# Altium project MIC_760_V2.PrjPcb
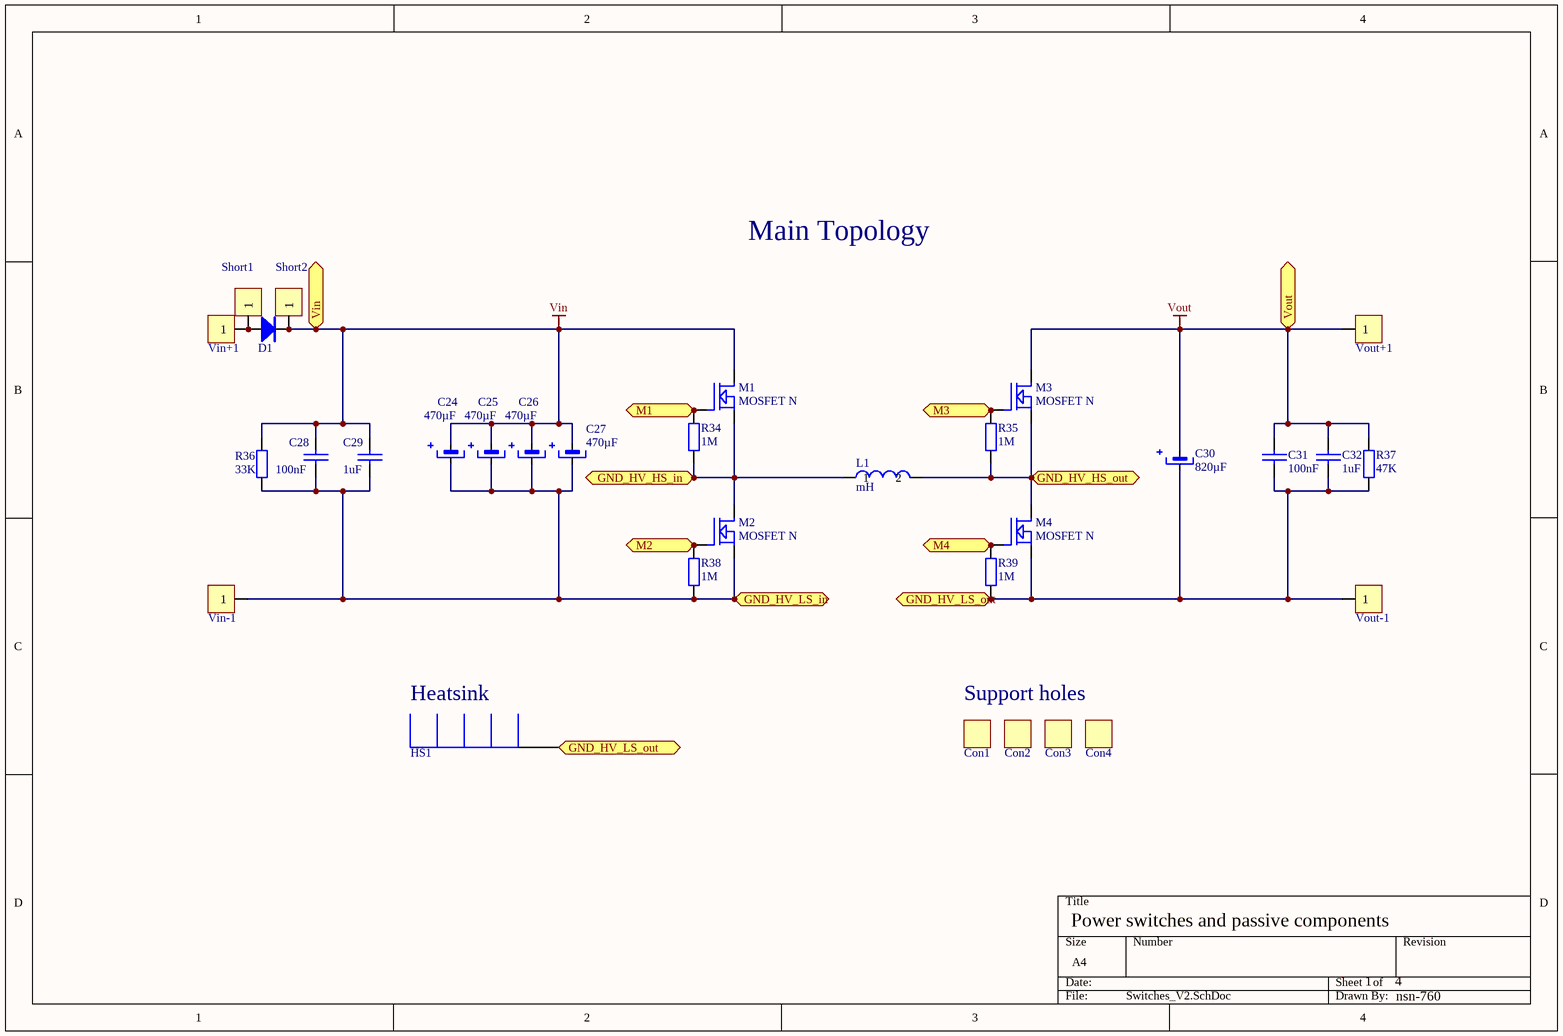
[diagram p0: Switches_V2.SchDoc]
4 sheets, 143 parts. Net scope: flat (ports and power ports of the same name join across sheets).
Board file: PCB5_V2.PcbDoc
Sheets:
  Switches_V2.SchDoc
  Drivers_V2.SchDoc
  Power_supplies_V2.SchDoc
  Signal_processing_V2.SchDoc

## Sheet Switches_V2.SchDoc
size A4

### Parts
C24  470µF  [CE_16Dx35mm_pitch7.5mm]
C25  470µF  [CE_16Dx35mm_pitch7.5mm]
C26  470µF  [CE_16Dx35mm_pitch7.5mm]
C27  470µF  [CE_16Dx35mm_pitch7.5mm]
C28  100nF  [1812]
C29  1uF  [1812]
C30  820µF  [CE_30Dx35mm_pitch10mm]
C31  100nF  [1812]
C32  1uF  [1812]
Con1  Support  [Support]  (value not drawn)
Con2  Support  [Support]  (value not drawn)
Con3  Support  [Support]  (value not drawn)
Con4  Support  [Support]  (value not drawn)
D1  ????  [D2PAK - Diode]  (value not drawn)
HS1  Heatsink  [Heatsink60x60]
L1  mH  [Torus_Coil_1mH]
M1  MOSFET N  [D2PAK - MOSFET]
M2  MOSFET N  [D2PAK - MOSFET]
M3  MOSFET N  [D2PAK - MOSFET]
M4  MOSFET N  [D2PAK - MOSFET]
R34  1M  [1206]
R35  1M  [1206]
R36  33K  [1206]
R37  47K  [1206]
R38  1M  [1206]
R39  1M  [1206]
Short1  CON1  [ShortPad]  (value not drawn)
Short2  CON1  [ShortPad]  (value not drawn)
Vin+1  CON1  [PowerHole]  (value not drawn)
Vin-1  CON1  [PowerHole]  (value not drawn)
Vout+1  CON1  [PowerHole]  (value not drawn)
Vout-1  CON1  [PowerHole]  (value not drawn)

### Ports
GND_HV_HS_in, GND_HV_HS_out, GND_HV_LS_in, GND_HV_LS_out, M1, M2, M3, M4, Vin, Vout

### Nets
GND_HV_HS_in: L1.1 M1.S M2.D R34.2 ; port GND_HV_HS_in
GND_HV_HS_out: L1.2 M3.S M4.D R35.2 ; port GND_HV_HS_out
GND_HV_LS_in: C24.2 C25.2 C26.2 C27.2 C28.2 C29.2 M2.S R36.2 R38.2 Vin-1.1 ; port GND_HV_LS_in
GND_HV_LS_out: C30.2 C31.2 C32.2 HS1.1 M4.S R37.2 R39.2 Vout-1.1 ; port GND_HV_LS_out
Vin: C24.1 C25.1 C26.1 C27.1 C28.1 C29.1 D1.K M1.D R36.1 Short2.1 ; port Vin
Vout: C30.1 C31.1 C32.1 M3.D R37.1 Vout+1.1 ; port Vout
NetD1_A: D1.A Short1.1 Vin+1.1
NetM1_G: M1.G R34.1 ; port M1
NetM2_G: M2.G R38.1 ; port M2
NetM3_G: M3.G R35.1 ; port M3
NetM4_G: M4.G R39.1 ; port M4

### Notes on the sheet
- Main Topology
- Support holes
- Power switches and passive components
- 1
- 4
- nsn-760

### Library data of the parts
C24-C27 C30 = Cond_Electrolítico: Condensador Aluminio con polaridad
C28 C29 C31 C32 = Condensador
D1 = Diodo
L1 = Bobina
M1-M4 = MOSFET N: MOSFET de canal N
R34-R39 = Resistencia: Potencia: 1/4W

## Sheet Drivers_V2.SchDoc
size A4
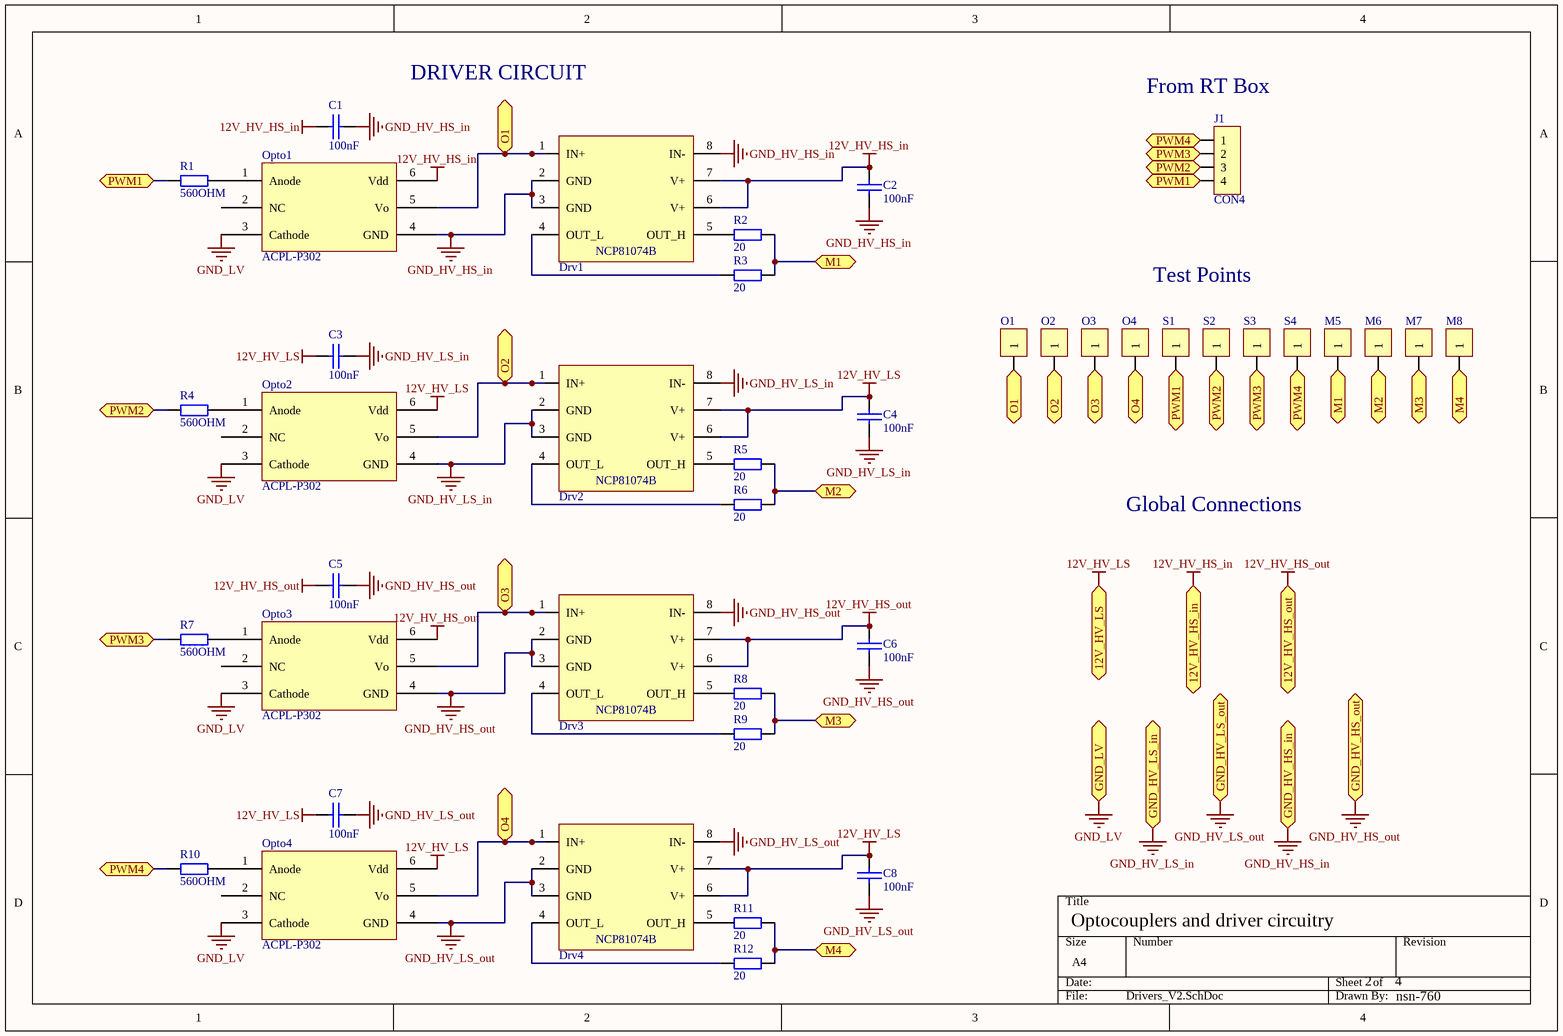
[diagram p1: Drivers_V2.SchDoc]

### Parts
C1  100nF  [1206]
C2  100nF  [1206]
C3  100nF  [1206]
C4  100nF  [1206]
C5  100nF  [1206]
C6  100nF  [1206]
C7  100nF  [1206]
C8  100nF  [1206]
Drv1  NCP81074B  [NCP81074A]  (value not drawn)
Drv2  NCP81074B  [NCP81074A]  (value not drawn)
Drv3  NCP81074B  [NCP81074A]  (value not drawn)
Drv4  NCP81074B  [NCP81074A]  (value not drawn)
J1  CON4  [Con4_Extron _3.5mmPitch]
M5  Test Point  [Test_Point]  (value not drawn)
M6  Test Point  [Test_Point]  (value not drawn)
M7  Test Point  [Test_Point]  (value not drawn)
M8  Test Point  [Test_Point]  (value not drawn)
O1  Test Point  [Test_Point]  (value not drawn)
O2  Test Point  [Test_Point]  (value not drawn)
O3  Test Point  [Test_Point]  (value not drawn)
O4  Test Point  [Test_Point]  (value not drawn)
Opto1  ACPL-P302  [SSOIC6]
Opto2  ACPL-P302  [SSOIC6]
Opto3  ACPL-P302  [SSOIC6]
Opto4  ACPL-P302  [SSOIC6]
R1  560OHM  [1206]
R2  20  [1206]
R3  20  [1206]
R4  560OHM  [1206]
R5  20  [1206]
R6  20  [1206]
R7  560OHM  [1206]
R8  20  [1206]
R9  20  [1206]
R10  560OHM  [1206]
R11  20  [1206]
R12  20  [1206]
S1  Test Point  [Test_Point]  (value not drawn)
S2  Test Point  [Test_Point]  (value not drawn)
S3  Test Point  [Test_Point]  (value not drawn)
S4  Test Point  [Test_Point]  (value not drawn)

### Ports
12V_HV_HS_in, 12V_HV_HS_out, 12V_HV_LS, GND_HV_HS_in, GND_HV_HS_out, GND_HV_LS_in, GND_HV_LS_out, GND_LV, M1, M2, M3, M4, O1, O2, O3, O4, PWM1, PWM2, PWM3, PWM4

### Nets
12V_HV_HS_in: C1.1 C2.1 Drv1.6(V+) Drv1.7(V+) Opto1.6(Vdd) ; port 12V_HV_HS_in
12V_HV_HS_out: C5.1 C6.1 Drv3.6(V+) Drv3.7(V+) Opto3.6(Vdd) ; port 12V_HV_HS_out
12V_HV_LS: C3.1 C4.1 C7.1 C8.1 Drv2.6(V+) Drv2.7(V+) Drv4.6(V+) Drv4.7(V+) Opto2.6(Vdd) Opto4.6(Vdd) ; port 12V_HV_LS
GND_HV_HS_in: C1.2 C2.2 Drv1.2(GND) Drv1.3(GND) Drv1.8(IN-) Opto1.4(GND) ; port GND_HV_HS_in
GND_HV_HS_out: C5.2 C6.2 Drv3.2(GND) Drv3.3(GND) Drv3.8(IN-) Opto3.4(GND) ; port GND_HV_HS_out
GND_HV_LS_in: C3.2 C4.2 Drv2.2(GND) Drv2.3(GND) Drv2.8(IN-) Opto2.4(GND) ; port GND_HV_LS_in
GND_HV_LS_out: C7.2 C8.2 Drv4.2(GND) Drv4.3(GND) Drv4.8(IN-) Opto4.4(GND) ; port GND_HV_LS_out
GND_LV: Opto1.3(Cathode) Opto2.3(Cathode) Opto3.3(Cathode) Opto4.3(Cathode) ; port GND_LV
NetDrv1_1: Drv1.1(IN+) O1.1 Opto1.5(Vo) ; port O1
NetDrv1_4: Drv1.4(OUT_L) R3.2
NetDrv1_5: Drv1.5(OUT_H) R2.2
NetDrv2_1: Drv2.1(IN+) O2.1 Opto2.5(Vo) ; port O2
NetDrv2_4: Drv2.4(OUT_L) R6.2
NetDrv2_5: Drv2.5(OUT_H) R5.2
NetDrv3_1: Drv3.1(IN+) O3.1 Opto3.5(Vo) ; port O3
NetDrv3_4: Drv3.4(OUT_L) R9.2
NetDrv3_5: Drv3.5(OUT_H) R8.2
NetDrv4_1: Drv4.1(IN+) O4.1 Opto4.5(Vo) ; port O4
NetDrv4_4: Drv4.4(OUT_L) R12.2
NetDrv4_5: Drv4.5(OUT_H) R11.2
NetJ1_1: J1.1 R10.2 S4.1 ; port PWM4
NetJ1_2: J1.2 R7.2 S3.1 ; port PWM3
NetJ1_3: J1.3 R4.2 S2.1 ; port PWM2
NetJ1_4: J1.4 R1.2 S1.1 ; port PWM1
NetM1_G: M5.1 R2.1 R3.1 ; port M1
NetM2_G: M6.1 R5.1 R6.1 ; port M2
NetM3_G: M7.1 R8.1 R9.1 ; port M3
NetM4_G: M8.1 R11.1 R12.1 ; port M4
NetOpto1_1: Opto1.1(Anode) R1.1
NetOpto2_1: Opto2.1(Anode) R4.1
NetOpto3_1: Opto3.1(Anode) R7.1
NetOpto4_1: Opto4.1(Anode) R10.1

Not connected (* = marked no-connect by the designer): Opto1 2(NC); Opto2 2(NC); Opto3 2(NC); Opto4 2(NC)

### Notes on the sheet
- DRIVER CIRCUIT
- (near J1) From RT Box
- Test Points
- Global Connections
- Optocouplers and driver circuitry
- 2
- 4
- nsn-760

### Library data of the parts
C1-C8 = Condensador
Opto1-Opto4 = Opto_ACPL
R1-R12 = Resistencia: Potencia: 1/4W

## Sheet Power_supplies_V2.SchDoc
size A4
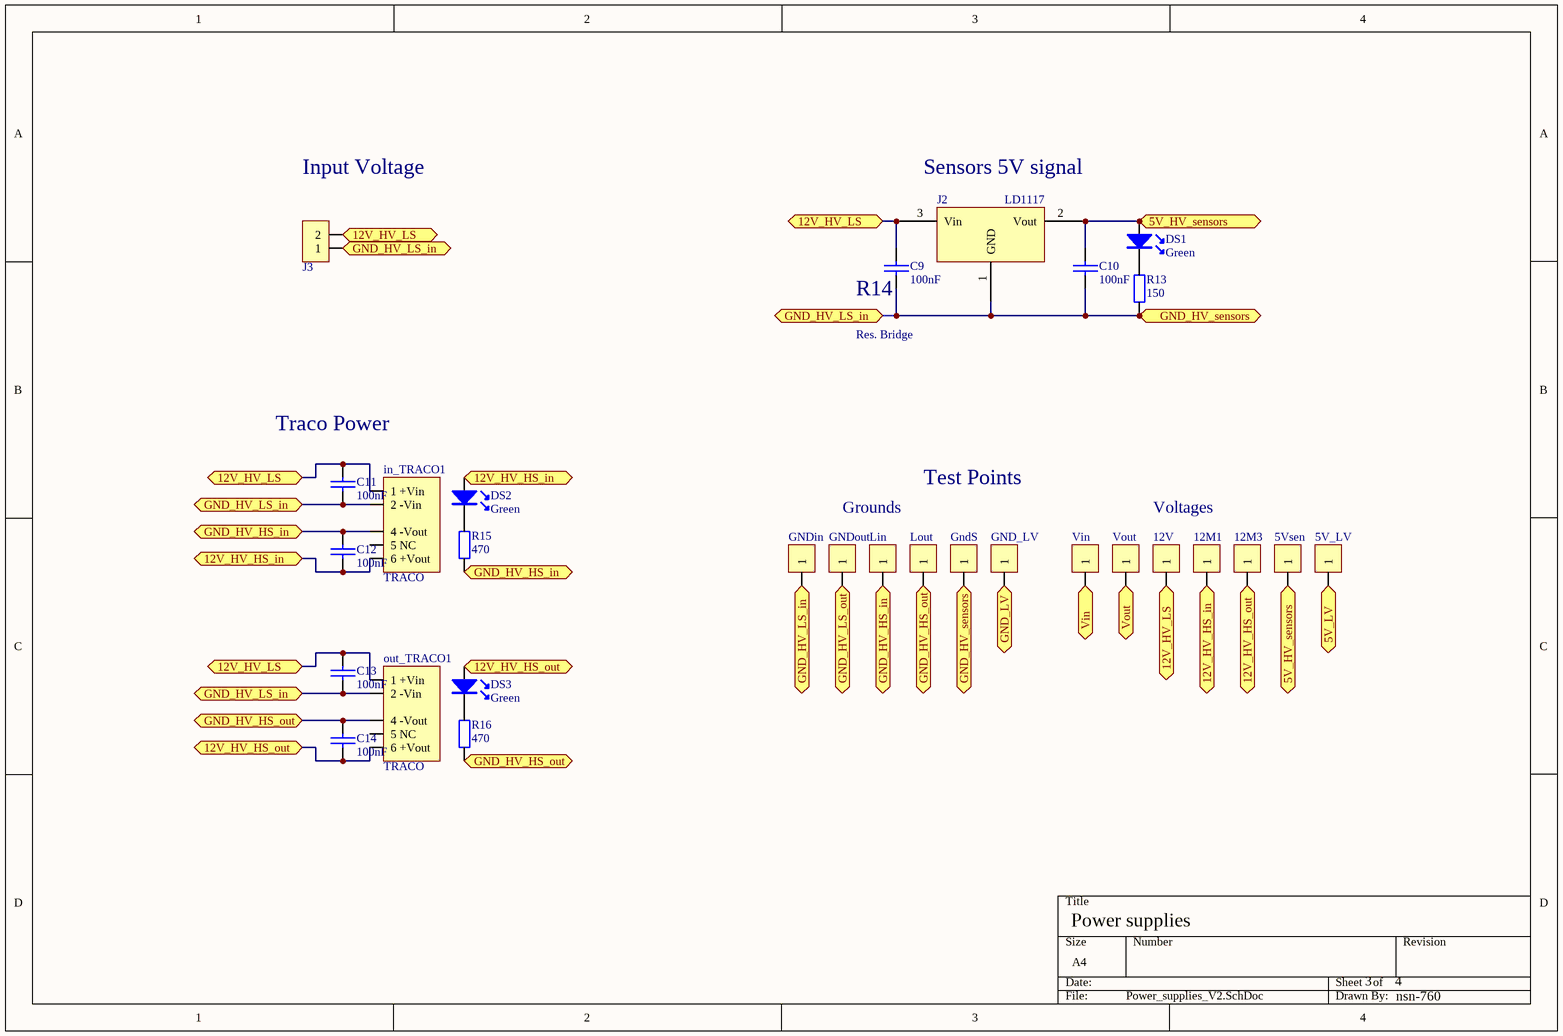
[diagram p2: Power_supplies_V2.SchDoc]

### Parts
5V_LV  Test Point  [Test_Point]  (value not drawn)
5Vsen  Test Point  [Test_Point]  (value not drawn)
12M1  Test Point  [Test_Point]  (value not drawn)
12M3  Test Point  [Test_Point]  (value not drawn)
12V  Test Point  [Test_Point]  (value not drawn)
C9  100nF  [1206]
C10  100nF  [1206]
C11  100nF  [1206]
C12  100nF  [1206]
C13  100nF  [1206]
C14  100nF  [1206]
DS1  Green  [Led 2.2mm]
DS2  Green  [Led 2.2mm]
DS3  Green  [Led 2.2mm]
GND_LV  Test Point  [Test_Point]  (value not drawn)
GNDin  Test Point  [Test_Point]  (value not drawn)
GNDout  Test Point  [Test_Point]  (value not drawn)
GndS  Test Point  [Test_Point]  (value not drawn)
in_TRACO1  TRACO  [TRACO_TMA1212S]
J2  LD1117  [SOT-223_LM1117]
J3  Cleva 2 vias  [Con2_Extron _3.5mmPitch]  (value not drawn)
Lin  Test Point  [Test_Point]  (value not drawn)
Lout  Test Point  [Test_Point]  (value not drawn)
out_TRACO1  TRACO  [TRACO_TMA1212S]
R13  150  [1206]
R14  Res. Bridge  [1206]
R15  470  [1206]
R16  470  [1206]
Vin  Test Point  [Test_Point]  (value not drawn)
Vout  Test Point  [Test_Point]  (value not drawn)

### Ports
5V_HV_sensors, 5V_LV, 12V_HV_HS_in, 12V_HV_HS_out, 12V_HV_LS, GND_HV_HS_in, GND_HV_HS_out, GND_HV_LS_in, GND_HV_LS_out, GND_HV_sensors, GND_LV, Vin, Vout

### Nets
5V_HV: 5Vsen.1 C10.2 DS1.A J2.2(Vout) ; port 5V_HV_sensors
5V_LV: 5V_LV.1 ; port 5V_LV
12V_HV_HS_in: 12M1.1 C12.1 DS2.A in_TRACO1.6(6_+Vout) ; port 12V_HV_HS_in
12V_HV_HS_out: 12M3.1 C14.1 DS3.A out_TRACO1.6(6_+Vout) ; port 12V_HV_HS_out
12V_HV_LS: 12V.1 C9.2 C11.2 C13.2 in_TRACO1.1(1_+Vin) J2.3(Vin) J3.2 out_TRACO1.1(1_+Vin) ; port 12V_HV_LS
GND_HV_HS_in: C12.2 in_TRACO1.4(4_-Vout) Lin.1 R15.2 ; port GND_HV_HS_in
GND_HV_HS_out: C14.2 Lout.1 out_TRACO1.4(4_-Vout) R16.2 ; port GND_HV_HS_out
GND_HV_LS_in: C11.1 C13.1 GNDin.1 in_TRACO1.2(2_-Vin) J3.1 out_TRACO1.2(2_-Vin) R14.1 ; port GND_HV_LS_in
GND_HV_LS_out: GNDout.1 ; port GND_HV_LS_out
GND_HV_sensors: C9.1 C10.1 GndS.1 J2.1(GND) R13.2 R14.2 ; port GND_HV_sensors
GND_LV: GND_LV.1 ; port GND_LV
Vin: Vin.1 ; port Vin
Vout: Vout.1 ; port Vout
NetDS1_K: DS1.K R13.1
NetDS2_K: DS2.K R15.1
NetDS3_K: DS3.K R16.1

Not connected (* = marked no-connect by the designer): in_TRACO1 5(5_NC); out_TRACO1 5(5_NC)

### Notes on the sheet
- Input Voltage
- Sensors 5V signal
- Traco Power
- Grounds
- Test Points
- Voltages
- Power supplies
- 3
- 4
- nsn-760

### Library data of the parts
C9-C14 = Condensador
DS1-DS3 = Led
in_TRACO1 out_TRACO1 = TRACO: TracoPower TMA1212S
J2 = LD1117: Linear voltage regulator
J3 = Con_2
R13 R15 R16 = Resistencia: Potencia: 1/4W
R14 = Res. Bridge: Resistencia Bridge

## Sheet Signal_processing_V2.SchDoc
size A4
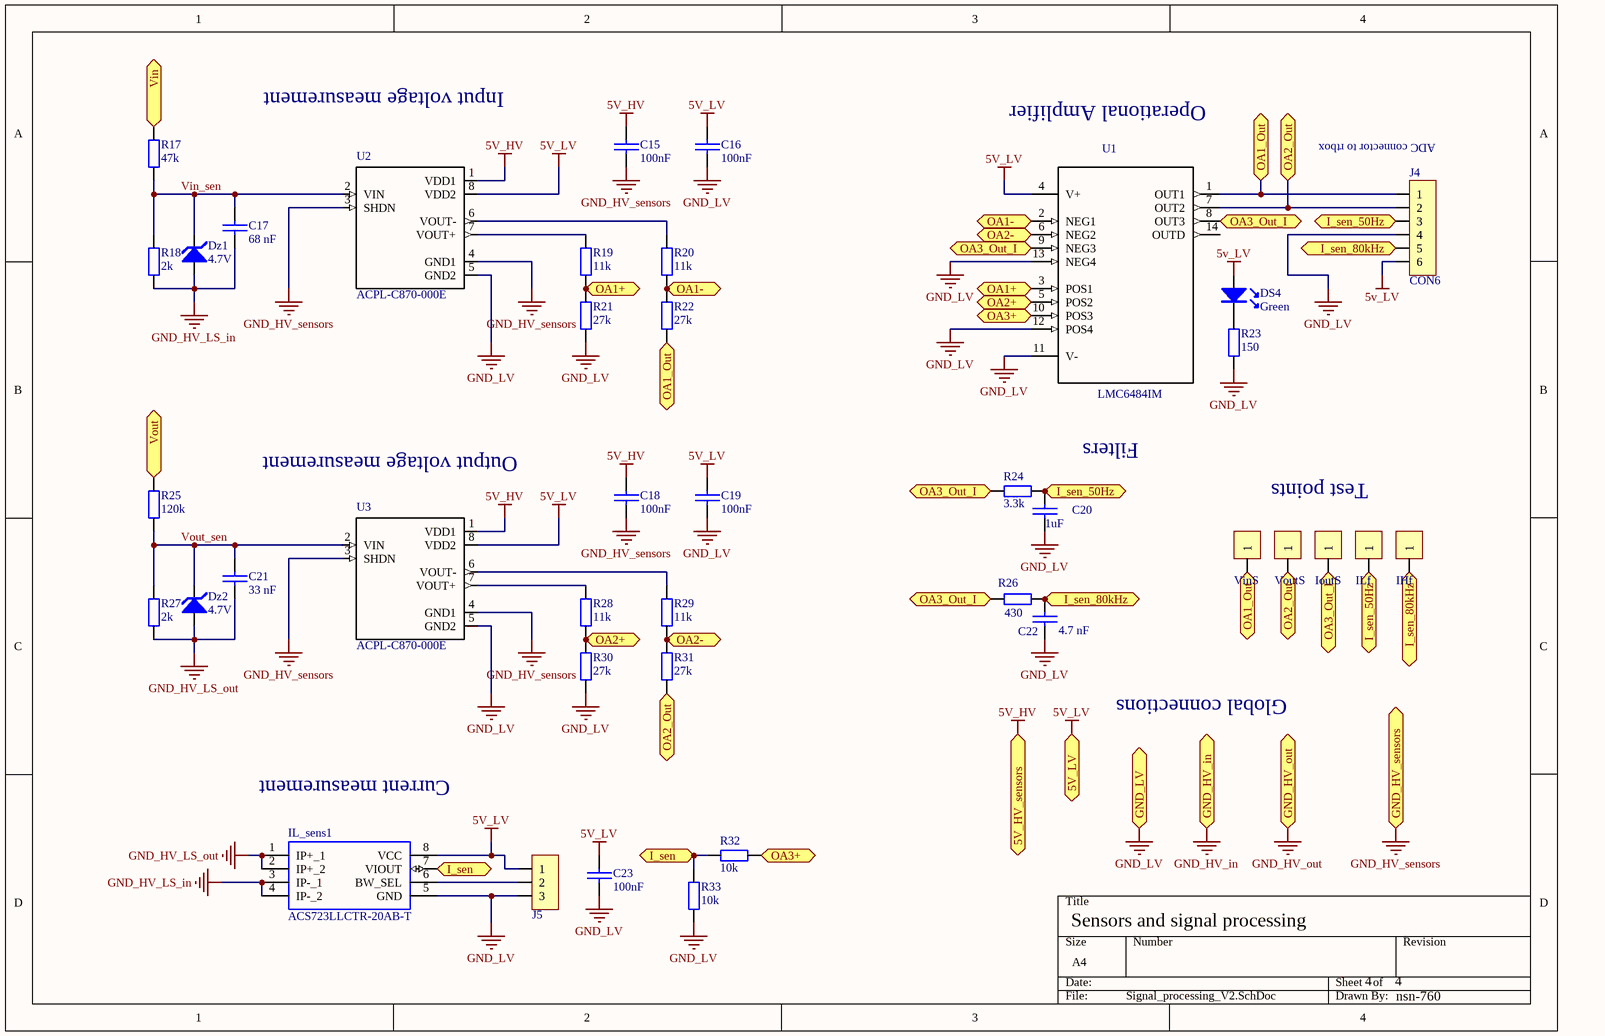
[diagram p3: Signal_processing_V2.SchDoc]

### Parts
C15  100nF  [1206]
C16  100nF  [1206]
C17  68 nF  [Condensador_MKP_200milis - duplicate]
C18  100nF  [1206]
C19  100nF  [1206]
C20  1uF  [Condensador_MKP_200milis - duplicate]
C21  33 nF  [Condensador_MKP_200milis - duplicate]
C22  4.7 nF  [Condensador_MKP_200milis - duplicate]
C23  100nF  [1206]
DS4  Green  [Led 2.2mm]
Dz1  4.7V  [SOT23 - zenner]
Dz2  4.7V  [SOT23 - zenner]
IHf  Test Point  [Test_Point]  (value not drawn)
IL_sens1  ACS723LLCTR-20AB-T  [SOIC8_GND]
ILf  Test Point  [Test_Point]  (value not drawn)
IoutS  Test Point  [Test_Point]  (value not drawn)
J4  CON6  [CON6_KK_256]
J5  Cleva 2 vias  [con_3_100milis]  (value not drawn)
R17  47k  [1206]
R18  2k  [1206]
R19  11k  [1206]
R20  11k  [1206]
R21  27k  [1206]
R22  27k  [1206]
R23  150  [1206]
R24  3.3k  [1206]
R25  120k  [1206]
R26  430  [1206]
R27  2k  [1206]
R28  11k  [1206]
R29  11k  [1206]
R30  27k  [1206]
R31  27k  [1206]
R32  10k  [1206]
R33  10k  [1206]
U1  LMC6484IM  [SOIC_14]
U2  ACPL-C870-000E  [SSOP8]
U3  ACPL-C870-000E  [SSOP8]
VinS  Test Point  [Test_Point]  (value not drawn)
VoutS  Test Point  [Test_Point]  (value not drawn)

### Ports
5V_HV_sensors, 5V_LV, GND_HV_in, GND_HV_out, GND_HV_sensors, GND_LV, I_sen, I_sen_50Hz, I_sen_80kHz, OA1+, OA1-, OA1_Out, OA2+, OA2-, OA2_Out, OA3+, OA3_Out_I, Vin, Vout

### Nets
5V_HV: C15.2 C18.2 U2.1(VDD1) U3.1(VDD1) ; port 5V_HV_sensors
5V_LV: C16.2 C19.2 C23.2 DS4.A IL_sens1.8(VCC) J4.6 J5.1 U1.4(V+) U2.8(VDD2) U3.8(VDD2) ; port 5V_LV
GND_HV_in: port GND_HV_in
GND_HV_LS_in: C17.2 Dz1.1(A) IL_sens1.3(IP-_1) IL_sens1.4(IP-_2) R18.2
GND_HV_LS_out: C21.2 Dz2.1(A) IL_sens1.1(IP+_1) IL_sens1.2(IP+_2) R27.2
GND_HV_out: port GND_HV_out
GND_HV_sensors: C15.1 C18.1 U2.3(SHDN) U2.4(GND1) U3.3(SHDN) U3.4(GND1) ; port GND_HV_sensors
GND_LV: C16.1 C19.1 C20.2 C22.2 C23.1 IL_sens1.5(GND) J4.4 J5.3 R21.2 R23.2 R30.2 R33.2 U1.11(V-) U1.12(POS4) U1.13(NEG4) U2.5(GND2) U3.5(GND2) ; port GND_LV
Vin: R17.1 ; port Vin
Vout: R25.1 ; port Vout
Vin_sen: C17.1 Dz1.2(K) R17.2 R18.1 U2.2(VIN)
Vout_sen: C21.1 Dz2.2(K) R25.2 R27.1 U3.2(VIN)
NetC20_1: C20.1 ILf.1 J4.3 R24.1 ; port I_sen_50Hz
NetC22_1: C22.1 IHf.1 J4.5 R26.1 ; port I_sen_80kHz
NetDS4_K: DS4.K R23.1
NetIL_sens1_6: IL_sens1.6(BW_SEL) J5.2
NetIL_sens1_7: IL_sens1.7(VIOUT) R32.2 R33.1 ; port I_sen
NetIoutS_1: IoutS.1 R24.2 R26.2 U1.8(OUT3) U1.9(NEG3) ; port OA3_Out_I
NetJ4_1: J4.1 R22.2 U1.1(OUT1) VinS.1 ; port OA1_Out
NetJ4_2: J4.2 R31.2 U1.7(OUT2) VoutS.1 ; port OA2_Out
NetR19_1: R19.1 U2.7(VOUT+)
NetR19_2: R19.2 R21.1 U1.3(POS1) ; port OA1+
NetR20_1: R20.1 U2.6(VOUT-)
NetR20_2: R20.2 R22.1 U1.2(NEG1) ; port OA1-
NetR28_1: R28.1 U3.7(VOUT+)
NetR28_2: R28.2 R30.1 U1.5(POS2) ; port OA2+
NetR29_1: R29.1 U3.6(VOUT-)
NetR29_2: R29.2 R31.1 U1.6(NEG2) ; port OA2-
NetR32_1: R32.1 U1.10(POS3) ; port OA3+

Not connected (* = marked no-connect by the designer): U1 14(OUTD)

### Notes on the sheet
- Input voltage measurement
- Operational Amplifier
- (near J4) ADC connector to rtbox
- Output voltage measurement
- Filters
- Test points
- Global connections
- Current measurement
- Sensors and signal processing
- 4
- nsn-760

### Library data of the parts
C15-C23 = Condensador
DS4 = Led
Dz1 Dz2 = Zener: pin to pad: 1>A 2>K
IL_sens1 = ACS723LLCTR-20AB-T: Current Sensor AC/DC 5V 8-Pin SOIC N Allegro Microsystems ACS723LLCTR-20AB-T, Current Sensor, 8-Pin, SOIC; Geometry.Height: 1.75mm; RS Part Number: 1775552; Manufacturer_Name: Allegro Microsystems; Manufacturer_Part_Number: ACS723LLCTR-20AB-T; Datasheet Link: http://uk.rs-online.com/web/p/products/1775552
J4 = CON6: CONECTOR 6 PINES
J5 = Con_3
R17-R33 = Resistencia: Potencia: 1/4W
U1 = LMC6484IM_1: 14 pin CMOS Quad Rail to Rail Input and Output Operational Amplifier 55 per tube; MF: Texas Instruments; Price: None; MP: LMC6484IM; SnapEDA_Link: https://www.snapeda.com/parts/LMC6484IM/Texas%20Instruments/view-part/?ref=snap; Availability: Unavailable; Package: SOIC-14 Texas Instruments; Value: *
U2 U3 = ACPL-C870-000E: Isolation Amplifier [Broadcom] ACPL-C870-000E Isolation Amplifier; MF: Broadcom Limited; Package: SO-8 Broadcom; Digi-Key_Part_Number: 516-2578-5-ND; MP: ACPL-C870-000E; Digi-Key_Purchase_URL: https://www.digikey.dk/product-detail/en/broadcom-limited/ACPL-C870-000E/516-2578-5-ND/3523705?utm_source=snapeda&utm_medium=aggregator&utm_campaign=symbol; SnapEDA_Link: https://www.snapeda.com/parts/ACPL-C870-000E/Broadcom%20Limited/view-part/?ref=snap; Value: *

## Nets that join several sheets
5V_HV: Power_supplies_V2 (5Vsen.1 C10.2 DS1.A J2.2), Signal_processing_V2 (C15.2 C18.2 U2.1 U3.1)
5V_LV: Power_supplies_V2 (5V_LV.1), Signal_processing_V2 (10 pins)
12V_HV_HS_in: Drivers_V2 (5 pins), Power_supplies_V2 (12M1.1 C12.1 DS2.A in_TRACO1.6)
12V_HV_HS_out: Drivers_V2 (5 pins), Power_supplies_V2 (12M3.1 C14.1 DS3.A out_TRACO1.6)
12V_HV_LS: Drivers_V2 (10 pins), Power_supplies_V2 (8 pins)
GND_HV_HS_in: Switches_V2 (L1.1 M1.S M2.D R34.2), Drivers_V2 (6 pins), Power_supplies_V2 (C12.2 in_TRACO1.4 Lin.1 R15.2)
GND_HV_HS_out: Switches_V2 (L1.2 M3.S M4.D R35.2), Drivers_V2 (6 pins), Power_supplies_V2 (C14.2 Lout.1 out_TRACO1.4 R16.2)
GND_HV_LS_in: Switches_V2 (10 pins), Drivers_V2 (6 pins), Power_supplies_V2 (7 pins), Signal_processing_V2 (5 pins)
GND_HV_LS_out: Switches_V2 (8 pins), Drivers_V2 (6 pins), Power_supplies_V2 (GNDout.1), Signal_processing_V2 (5 pins)
GND_HV_sensors: Power_supplies_V2 (6 pins), Signal_processing_V2 (6 pins)
GND_LV: Drivers_V2 (Opto1.3 Opto2.3 Opto3.3 Opto4.3), Power_supplies_V2 (GND_LV.1), Signal_processing_V2 (17 pins)
Vin: Switches_V2 (10 pins), Power_supplies_V2 (Vin.1), Signal_processing_V2 (R17.1)
Vout: Switches_V2 (6 pins), Power_supplies_V2 (Vout.1), Signal_processing_V2 (R25.1)
NetM1_G: Switches_V2 (M1.G R34.1), Drivers_V2 (M5.1 R2.1 R3.1)
NetM2_G: Switches_V2 (M2.G R38.1), Drivers_V2 (M6.1 R5.1 R6.1)
NetM3_G: Switches_V2 (M3.G R35.1), Drivers_V2 (M7.1 R8.1 R9.1)
NetM4_G: Switches_V2 (M4.G R39.1), Drivers_V2 (M8.1 R11.1 R12.1)